# Altium schematic sheet eMMC_QSPI.SchDoc
size 386 x 246 mm; SheetNumber: 6; SheetTotal: 7
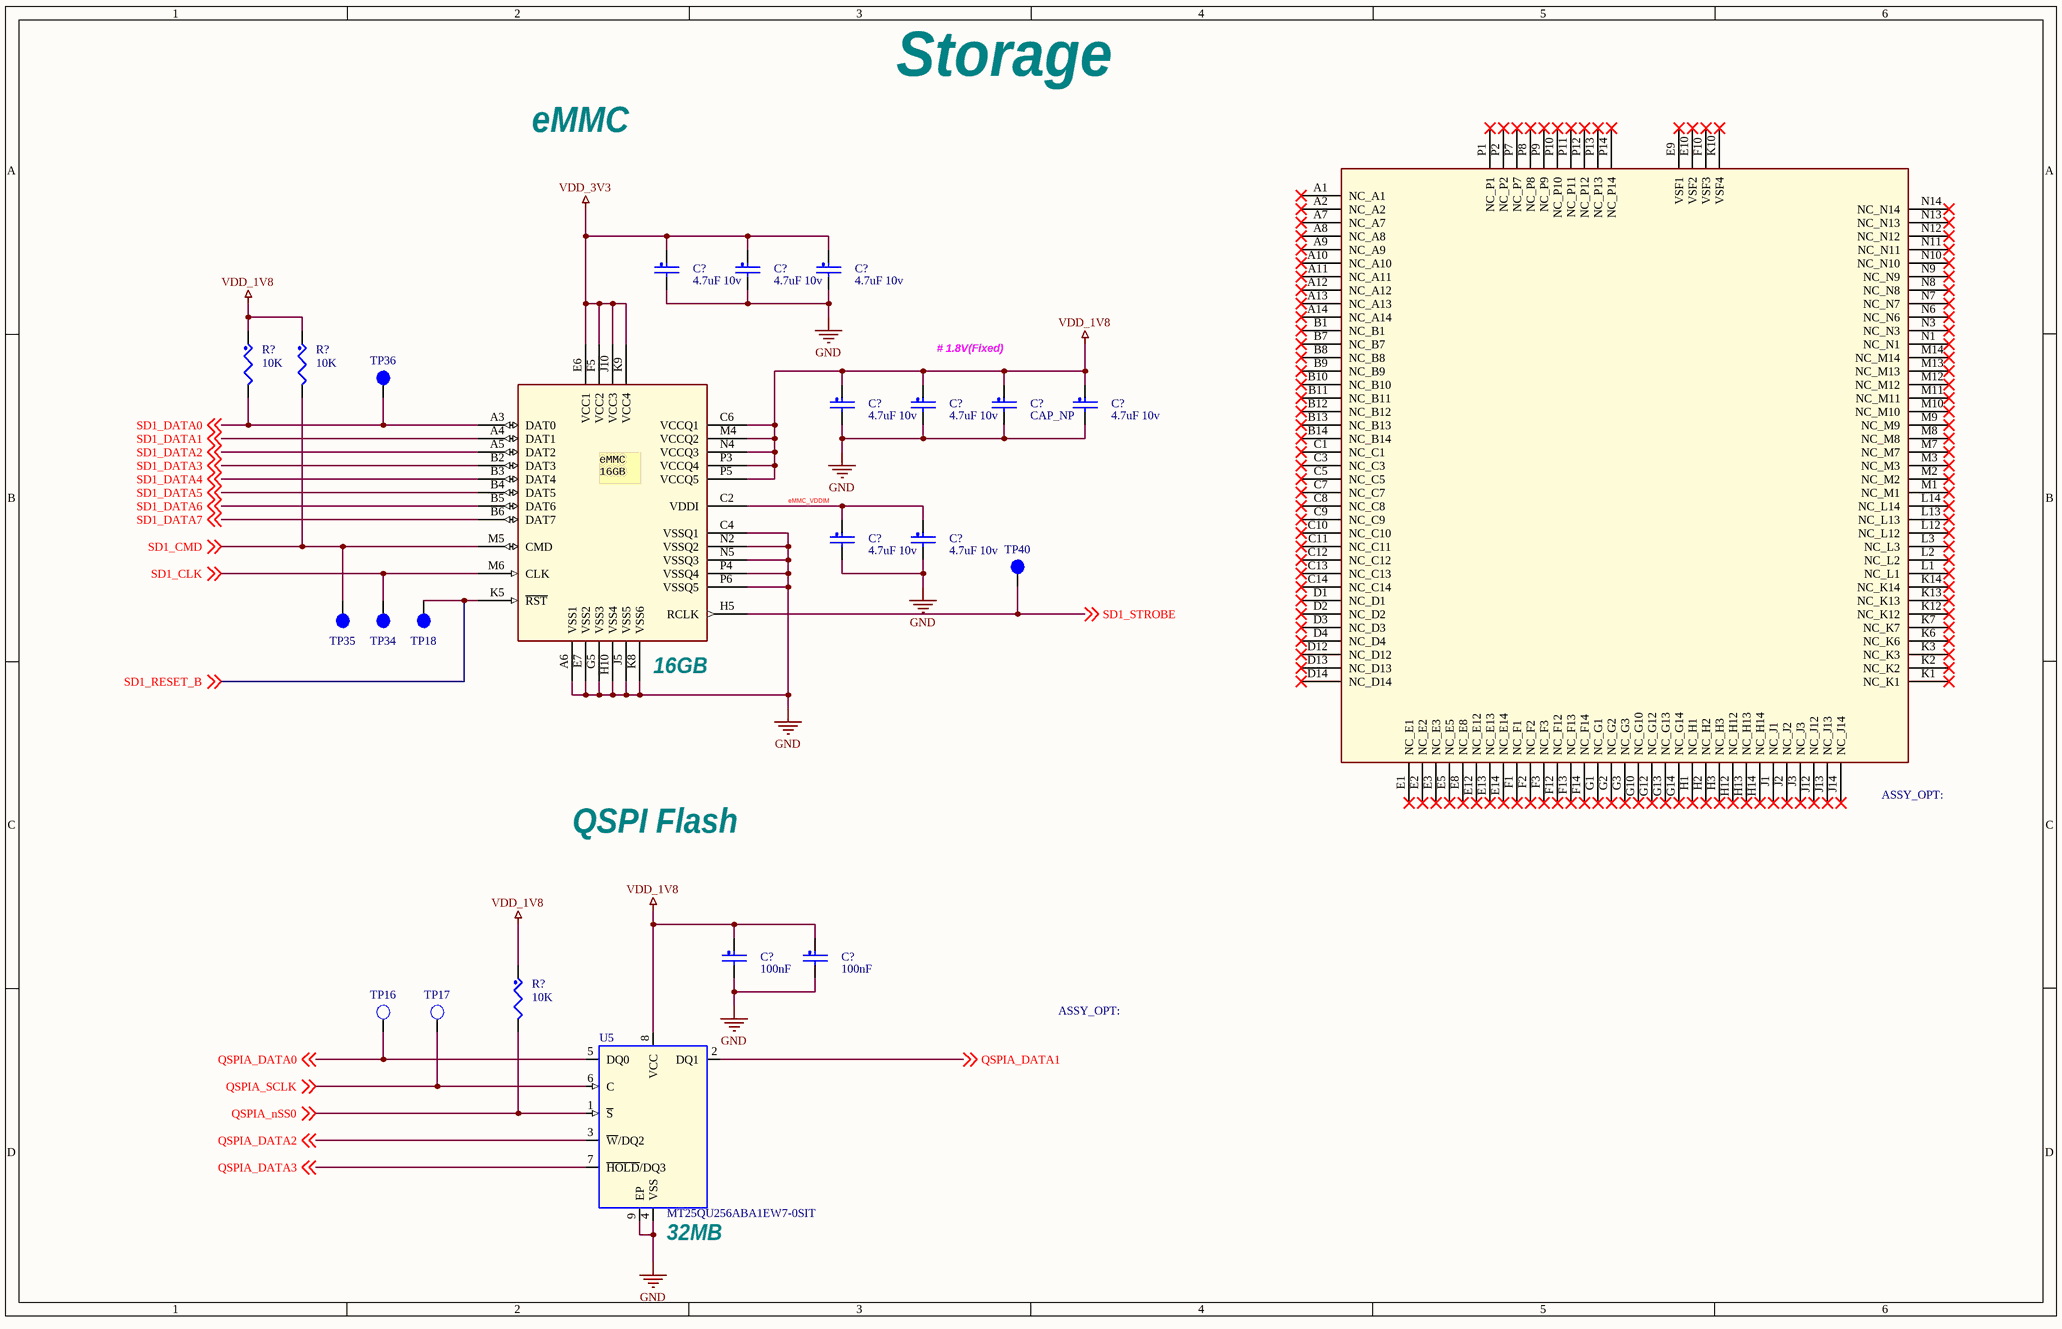
[diagram p0: eMMC_QSPI.SchDoc]

## Parts
(Parts that share a designator on the sheet are numbered #1, #2 ... from top to bottom, then left to right.)
C?#1  4.7uF 10v  [RC0402]
C?#2  4.7uF 10v  [RC0402]
C?#3  4.7uF 10v  [RC0402]
C?#4  4.7uF 10v  [RC0402]
C?#5  4.7uF 10v  [RC0402]
C?#6  CAP_NP  [RC0402]
C?#7  4.7uF 10v  [RC0402]
C?#8  4.7uF 10v  [RC0402]
C?#9  4.7uF 10v  [RC0402]
C?#10  100nF  [RC0402]
C?#11  100nF  [RC0402]
R?#1  10K  [RC0402X]
R?#2  10K  [RC0402X]
R?#3  10K  [RC0402X]
TP16  TP_35MIL  [testpoint_35mil]  (value not drawn)
TP17  TP_35MIL  [testpoint_35mil]  (value not drawn)
TP18  tpad_020  [tpad_020]  (value not drawn)
TP34  tpad_020  [tpad_020]  (value not drawn)
TP35  TPAD_015  [TPAD_015]  (value not drawn)
TP36  tpad_020  [tpad_020]  (value not drawn)
TP40  TPAD_015  [TPAD_015]  (value not drawn)
U5  MT25QU256ABA1EW7-0SIT  [dfn8_1p27_6x5mm_3p1]
U?#1  SDINBDG4-16G_VFBGA_153P  [BGA153N50P14X14_1300X1150X80]  (value not drawn)  (part B of 2)
U?#2  SDINBDG4-16G_VFBGA_153P  [BGA153N50P14X14_1300X1150X80]  (value not drawn)  (part A of 2)

## Nets
GND: C?#1.2 C?#2.2 C?#3.2 C?#4.2 C?#5.2 C?#6.2 C?#7.2 C?#8.2 C?#9.2 C?#10.2 C?#11.2 U5.4(VSS) U5.9(EP) U?#2.A6(VSS1) U?#2.C4(VSSQ1) U?#2.E7(VSS2) U?#2.G5(VSS3) U?#2.H10(VSS4) U?#2.J5(VSS5) U?#2.K8(VSS6) U?#2.N2(VSSQ2) U?#2.N5(VSSQ3) U?#2.P4(VSSQ4) U?#2.P6(VSSQ5)
VDD_1V8: C?#4.1 C?#5.1 C?#6.1 C?#7.1 C?#10.1 C?#11.1 R?#1.1 R?#2.1 R?#3.1 U5.8(VCC) U?#2.C6(VCCQ1) U?#2.M4(VCCQ2) U?#2.N4(VCCQ3) U?#2.P3(VCCQ4) U?#2.P5(VCCQ5)
VDD_3V3: C?#1.1 C?#2.1 C?#3.1 U?#2.E6(VCC1) U?#2.F5(VCC2) U?#2.J10(VCC3) U?#2.K9(VCC4)
eMMC_VDDIM: C?#8.1 C?#9.1 U?#2.C2(VDDI)
QSPIA_DATA0: TP16.1(TP) U5.5(DQ0) ; off-sheet QSPIA_DATA0
QSPIA_DATA1: U5.2(DQ1) ; off-sheet QSPIA_DATA1
QSPIA_DATA2: U5.3(~{W}/DQ2) ; off-sheet QSPIA_DATA2
QSPIA_DATA3: U5.7(~{HOLD}/DQ3) ; off-sheet QSPIA_DATA3
QSPIA_nSS0: R?#3.2 U5.1(~{S}) ; off-sheet QSPIA_nSS0
QSPIA_SCLK: TP17.1(TP) U5.6(C) ; off-sheet QSPIA_SCLK
SD1_CLK: TP34.1(Pin1) U?#2.M6(CLK) ; off-sheet SD1_CLK
SD1_CMD: R?#2.2 TP35.1(Pin1) U?#2.M5(CMD) ; off-sheet SD1_CMD
SD1_DATA0: R?#1.2 TP36.1(Pin1) U?#2.A3(DAT0) ; off-sheet SD1_DATA0
SD1_DATA1: U?#2.A4(DAT1) ; off-sheet SD1_DATA1
SD1_DATA2: U?#2.A5(DAT2) ; off-sheet SD1_DATA2
SD1_DATA3: U?#2.B2(DAT3) ; off-sheet SD1_DATA3
SD1_DATA4: U?#2.B3(DAT4) ; off-sheet SD1_DATA4
SD1_DATA5: U?#2.B4(DAT5) ; off-sheet SD1_DATA5
SD1_DATA6: U?#2.B5(DAT6) ; off-sheet SD1_DATA6
SD1_DATA7: U?#2.B6(DAT7) ; off-sheet SD1_DATA7
SD1_RESET_B: TP18.1(Pin1) U?#2.K5(~{RST}) ; off-sheet SD1_RESET_B
SD1_STROBE: TP40.1(Pin1) U?#2.H5(RCLK) ; off-sheet SD1_STROBE

Not connected (* = marked no-connect by the designer): U?#1 A1(NC_A1)* A2(NC_A2)* A7(NC_A7)* A8(NC_A8)* A9(NC_A9)* A10(NC_A10)* A11(NC_A11)* A12(NC_A12)* A13(NC_A13)* A14(NC_A14)* B1(NC_B1)* B7(NC_B7)* B8(NC_B8)* B9(NC_B9)* B10(NC_B10)* B11(NC_B11)* B12(NC_B12)* B13(NC_B13)* B14(NC_B14)* C1(NC_C1)* C3(NC_C3)* C5(NC_C5)* C7(NC_C7)* C8(NC_C8)* C9(NC_C9)* C10(NC_C10)* C11(NC_C11)* C12(NC_C12)* C13(NC_C13)* C14(NC_C14)* D1(NC_D1)* D2(NC_D2)* D3(NC_D3)* D4(NC_D4)* D12(NC_D12)* D13(NC_D13)* D14(NC_D14)* E1(NC_E1)* E2(NC_E2)* E3(NC_E3)* E5(NC_E5)* E8(NC_E8)* E9(VSF1)* E10(VSF2)* E12(NC_E12)* E13(NC_E13)* E14(NC_E14)* F1(NC_F1)* F2(NC_F2)* F3(NC_F3)* F10(VSF3)* F12(NC_F12)* F13(NC_F13)* F14(NC_F14)* G1(NC_G1)* G2(NC_G2)* G3(NC_G3)* G10(NC_G10)* G12(NC_G12)* G13(NC_G13)* G14(NC_G14)* H1(NC_H1)* H2(NC_H2)* H3(NC_H3)* H12(NC_H12)* H13(NC_H13)* H14(NC_H14)* J1(NC_J1)* J2(NC_J2)* J3(NC_J3)* J12(NC_J12)* J13(NC_J13)* J14(NC_J14)* K1(NC_K1)* K2(NC_K2)* K3(NC_K3)* K6(NC_K6)* K7(NC_K7)* K10(VSF4)* K12(NC_K12)* K13(NC_K13)* K14(NC_K14)* L1(NC_L1)* L2(NC_L2)* L3(NC_L3)* L12(NC_L12)* L13(NC_L13)* L14(NC_L14)* M1(NC_M1)* M2(NC_M2)* M3(NC_M3)* M7(NC_M7)* M8(NC_M8)* M9(NC_M9)* M10(NC_M10)* M11(NC_M11)* M12(NC_M12)* M13(NC_M13)* M14(NC_M14)* N1(NC_N1)* N3(NC_N3)* N6(NC_N6)* N7(NC_N7)* N8(NC_N8)* N9(NC_N9)* N10(NC_N10)* N11(NC_N11)* N12(NC_N12)* N13(NC_N13)* N14(NC_N14)* P1(NC_P1)* P2(NC_P2)* P7(NC_P7)* P8(NC_P8)* P9(NC_P9)* P10(NC_P10)* P11(NC_P11)* P12(NC_P12)* P13(NC_P13)* P14(NC_P14)*

## Notes on the sheet
- Storage
- eMMC
- (near C?#6) # 1.8V(Fixed)
- (near U?#2) 16GB
- QSPI Flash
- (near U5) 32MB
- (in symbol SDINBDG4-16G_VFBGA_153P, part A) eMMC / 16GB

## Library data of the parts
C?#1-C?#11 = CAP_NP: CLASS: DISCRETE
R?#1-R?#3 = RES: CLASS: DISCRETE
TP16 TP17 = T POINT R: TEST POINT PAD .035 SMT, no part to order; ASSY_OPT: DNP; CLASS: IC; CAD_APPROVED: Yes; AGILE_PN: 510-75618; HEIGHT: 0.1MM; ROHS: Yes; PCB Footprint: testpoint_35mil
TP18 TP36 = TESTLOOP: TEST POINT PAD 0.5MM DIA SMT, NO PART TO ORDER; CLASS: IO; ASSY_OPT: DNP; AGILE_PN: 211-77484; CAD_APPROVED: Yes; ROHS: Yes; HEIGHT: 0.1MM; PCB Footprint: tpad_020
TP34 = TESTLOOP: TEST POINT PAD 0.5MM DIA SMT, NO PART TO ORDER; CLASS: IO; ASSY_OPT: DNP; CAD_APPROVED: Yes; AGILE_PN: 211-77484; HEIGHT: 0.1MM; ROHS: Yes; PCB Footprint: tpad_020
TP35 = TESTLOOP: TEST POINT PAD 15MIL DIA SMT, NO PART TO ORDER; CLASS: IO; ASSY_OPT: DNP; AGILE_PN: 211-76645; MFG_NAME01: NOTACOMPONENT; CAD_APPROVED: Yes; MFG_PN01: NOTACOMPONENT; ROHS: Yes; HEIGHT: 0.1MM; PCB Footprint: TPAD_015
TP40 = TESTLOOP: TEST POINT PAD 15MIL DIA SMT, NO PART TO ORDER; CLASS: IO; AGILE_PN: 211-76645; MFG_NAME01: NOTACOMPONENT; CAD_APPROVED: Yes; MFG_PN01: NOTACOMPONENT; ROHS: Yes; HEIGHT: 0.1MM; PCB Footprint: TPAD_015
U5 = MT25QL256ABA1EW9_9P: IC MEM FLASH SERIAL NOR 256MBIT 166MHZ 1.7-2V WPDFN8; AGILE_PN: 334-77688; MFG_NAME01: MICRON; CAD_APPROVED: Yes; CLASS: IC; PCB Footprint: dfn8_1p27_6x5mm_3p1; MFG_PN01: MT25QU256ABA1EW7-0SIT; ROHS: Yes; HEIGHT: 0.8 MM; VOLTAGE: 1.7-2V
U?#1 U?#2 = SDINBDG4-16G_VFBGA_153P: CLASS: IC